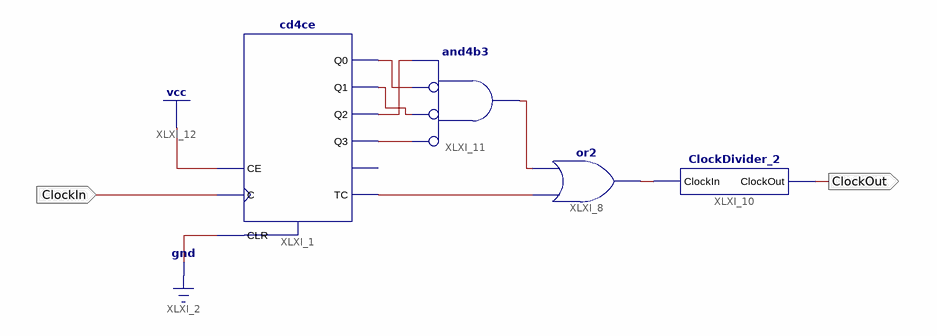
[diagram p0: schematic sheet 1]
// Xilinx ISE schematic ClockDivider_10.sch (spartan6) as structural Verilog: 4 symbols, 2 ports
module ClockDivider_10 (
  input  ClockIn,
  output ClockOut
);

  wire XLXN_14, XLXN_18, XLXN_20, XLXN_21, XLXN_22, XLXN_23, XLXN_24;

  cd4ce XLXI_1 (
    .C(ClockIn), .CE(1'b1), .CLR(1'b0), .Q0(XLXN_22), .Q1(XLXN_23), .Q2(XLXN_21), .Q3(XLXN_24), .TC(XLXN_14));  // open: CEO
  or XLXI_8 (XLXN_18, XLXN_14, XLXN_20);
  ClockDivider_2 XLXI_10 (.ClockIn(XLXN_18), .ClockOut(ClockOut));
  and XLXI_11 (XLXN_20, ~XLXN_24, ~XLXN_23, ~XLXN_22, XLXN_21);  // and4b3
endmodule
